# Altium schematic sheet Fan_Control.SchDoc
size A4; SheetNumber: 6; SheetTotal: 7
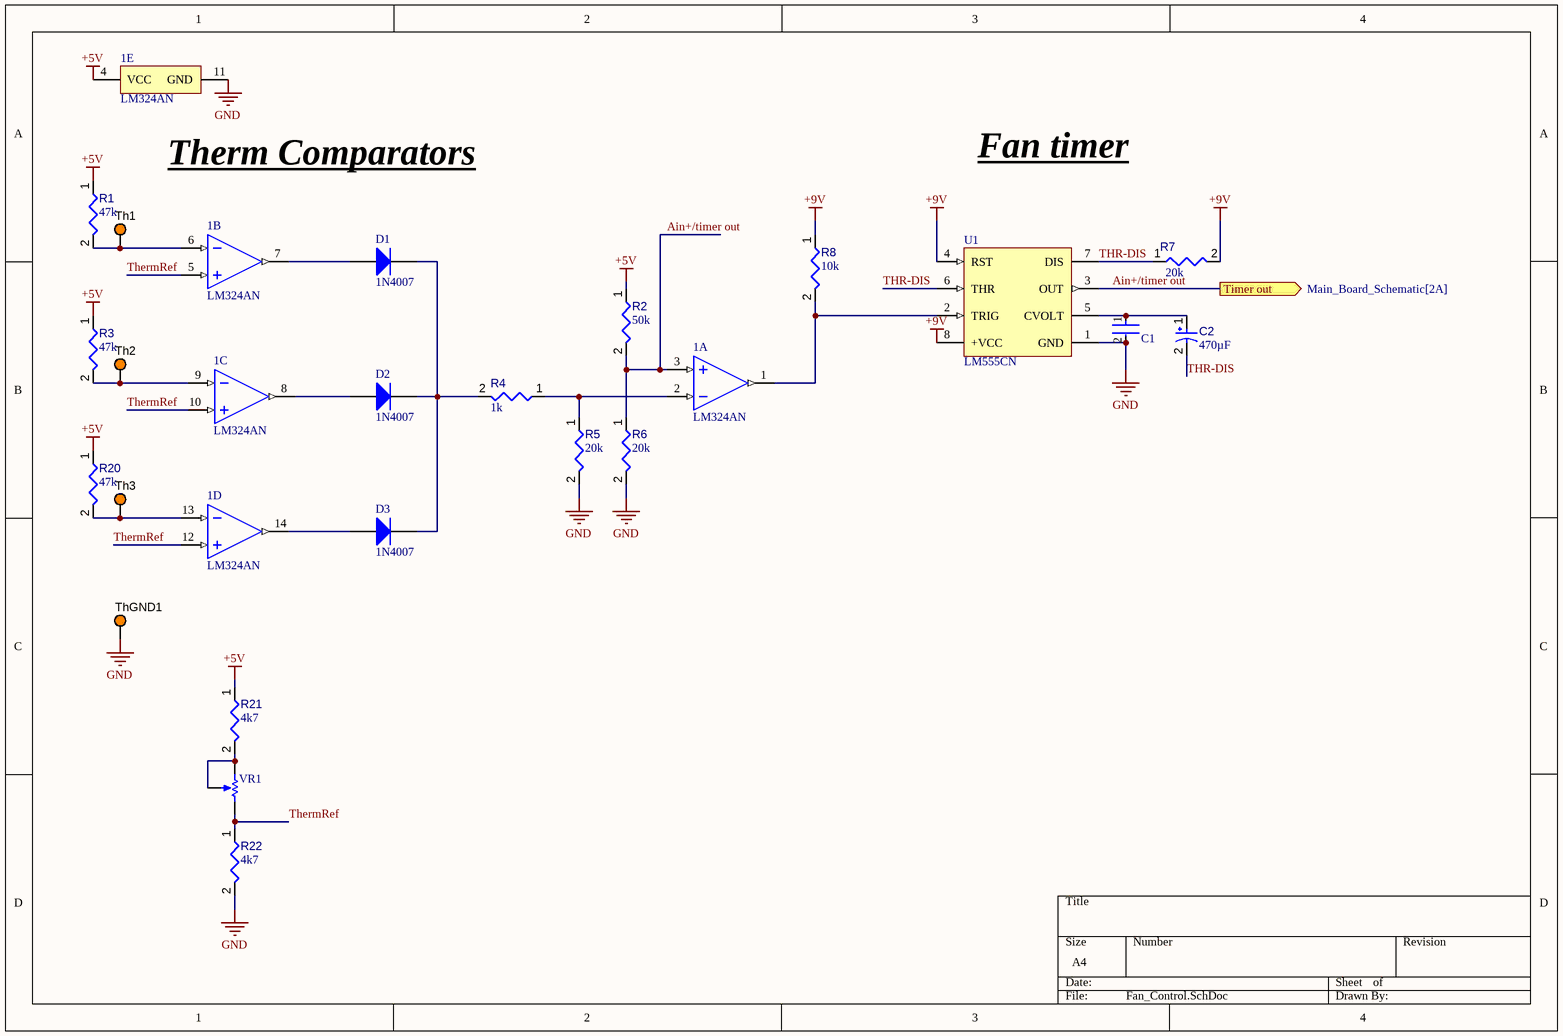
[diagram p0: Fan_Control.SchDoc]

## Parts
1  LM324AN  [TI-N0014A]  (parts A,B,C,D,E of 5)
C1  RCER71H103K0K1H03B  [FP-RCE0K1-MFG]  (value not drawn)
C2  value 470µF  [CAPPR65-350-1150X800X1250]  (hidden comment: ECA1HM101)
D1  1N4007  [FAIR-DO-41-2]
D2  1N4007  [FAIR-DO-41-2]
D3  1N4007  [FAIR-DO-41-2]
R1  value 47k  [RESA60-630X240]  (hidden comment: MFR-25FBF52-100R)
R2  value 50k  [RESA60-630X240]  (hidden comment: MFR-25FBF52-100R)
R3  value 47k  [RESA60-630X240]  (hidden comment: MFR-25FBF52-100R)
R4  value 1k  [RESA60-630X240]  (hidden comment: MFR-25FBF52-100R)
R5  value 20k  [RESA60-630X240]  (hidden comment: MFR-25FBF52-100R)
R6  value 20k  [RESA60-630X240]  (hidden comment: MFR-25FBF52-100R)
R7  value 20k  [RESA60-630X240]  (hidden comment: MFR-25FBF52-1K)
R8  value 10k  [RESA60-630X240]  (hidden comment: MFR-25FBF52-1K)
R20  value 47k  [RESA60-630X240]  (hidden comment: MFR-25FBF52-100R)
R21  value 4k7  [RESA60-630X240]  (hidden comment: MFR-25FBF52-100R)
R22  value 4k7  [RESA60-630X240]  (hidden comment: MFR-25FBF52-100R)
Th1  5003  [KSTN-5003]  (value not drawn)
Th2  5003  [KSTN-5003]  (value not drawn)
Th3  5003  [KSTN-5003]  (value not drawn)
ThGND1  5003  [KSTN-5003]  (value not drawn)
U1  LM555CN  [N08E]
VR1  3362P-1-104LF  [BOUR-3362P]  (value not drawn)

## Ports
Timer out (out, see Main_Board_Schematic[2A])

## Nets
+5V: 1.4(VCC) R1.1 R2.1 R3.1 R20.1 R21.1
+9V: R7.2 R8.1 U1.4(RST) U1.8(+VCC)
GND: 1.11(GND) C1.2 R5.2 R6.2 R22.2 ThGND1.1 U1.1(GND)
Ain+/timer out: 1.3(1IN+) R2.2 R6.1 U1.3(OUT) ; port Timer out
ThermRef: 1.5(2IN+) 1.10(3IN+) 1.12(4IN+) R22.1 VR1.3(CW)
THR-DIS: C2.2 R7.1 U1.6(THR) U1.7(DIS)
Net1_1: 1.1(1OUT) R8.2 U1.2(TRIG)
Net1_2: 1.2(1IN-) R4.1 R5.1
Net1_6: 1.6(2IN-) R1.2 Th1.1
Net1_7: 1.7(2OUT) D1.2(A)
Net1_8: 1.8(3OUT) D2.2(A)
Net1_9: 1.9(3IN-) R3.2 Th2.1
Net1_13: 1.13(4IN-) R20.2 Th3.1
Net1_14: 1.14(4OUT) D3.2(A)
NetC1_1: C1.1 C2.1 U1.5(CVOLT)
NetD1_1: D1.1(K) D2.1(K) D3.1(K) R4.2
NetR21_2: R21.2 VR1.1(CCW) VR1.2(S)

## Notes on the sheet
- Therm Comparators
- Fan timer

## Library data of the parts
1 = CMP-014-00016-2: Quadruple Operational Amplifier, 1.2 MHz, 0 to 70 degC, 14-Pin PDIP (N), Pb-Free (RoHS), Tube; Manufacturer: Texas Instruments (TI); Max Dual Supply Voltage: 16V; Nominal Dual Supply Voltage: 12V; Nominal Voltage Gain: 100dB; Min Supply Voltage: 1.5V; Unity Gain Bandwidth Product: 1.2MHz; Output Current: 30mA; Nominal Supply Current: 3mA; RoHS Compliant: True; Package Reference: N-14; Min Operating Temperature: 0°C; Case/Package: DIP; Mounting Technology: TH; Package Description: 14-Pin Double In-line Package, Body 19.305 x 6.35 mm, Pitch 2.54 mm; Nominal Supply Voltage: 12V; Package URL: http://www.ti.com/lit/ml/mpdi002c/mpdi002c.pdf; Package Quantity: 25; Datasheet Version: SLOS066W, 03/2015; Manufacturer URL: http://www.ti.com/; Datasheet URL: http://www.ti.com/lit/ds/symlink/lm324a.pdf; Min Dual Supply Voltage: 1.5V; Max Supply Voltage: 16V; Pins: 14; Max Operating Temperature: 70°C
C1 = CMP-06035-044411-1: Cap Ceramic 10nF 50V X7R ±10% Radial 5mm +125°C Automotive Bulk; Lead/Base Style: Formed Leads; Lead Diameter: 0.5mm; Resistor Type: Ceramic; Mount: Through Hole; Capacitance: 10nF; Lead Pitch: 0.197inch; Package Quantity: 500; Dielectric: X7R; Lead Free: Lead Free; Min Operating Temperature: -55°C; Packaging: Bulk; Width: 0.098inch; Length: 0.142inch; Voltage Rating: 50V; Case/Package: Radial; Max Operating Temperature: 125°C; Ratings: AEC-Q200; Height - Seated (Max): 0.138inch; Height: 3.5mm; Termination: Radial; Voltage Rating (DC): 50V; Tolerance: 10%
C2 = CMP-001-00026-7: Aluminum Electrolytic Capacitor, 100 uF, +/- 20%, 50 V, -40 to 85 degC, 2-Pin THD, RoHS, Bulk; Manufacturer: Panasonic; Voltage Rating: 50V; Ripple Current: 250mA; Datasheet URL: https://industrial.panasonic.com/cdbs/www-data/pdf/RDF0000/ABA0000C1218.pdf; Lead Pitch: 3.5mm; Mounting Technology: TH; Package Description: 2-Pin Radial Lead, Dia 8 mm, Height 12.5 mm; Diameter: 8mm; Ripple Current (AC): 250mA; Manufacturer URL: http://www.panasonic.com/; Capacitor Type: Electrolytic; Max Operating Temperature: 85°C; Pins: 2; Min Operating Temperature: -40°C; Tolerance: 20%; Case/Package: Radial; Packaging: Bulk; Package Quantity: 200; Package Reference: CAPPR65-350-1150X800X1250; RoHS Compliant: True; Datasheet Version: Rev. 05, 10/2016
D1-D3 = CMP-004-00007-2: General Purpose Rectifier, 1.1 V, 1.0 A, -55 to 175 degC, 2-Pin DO-41, RoHS, Tape and Reel; Manufacturer: Fairchild; Peak Reverse Current: 5uA; Max Surge Current: 30A; Elements: 1; Forward Voltage: 1.1V; Package Version: Rev. 2, 09/2008; Forward Current: 1A; Package Quantity: 5000; Packaging: TapeandReel; Package URL: http://www.fairchildsemi.com/dwg/DO/DO41A.pdf; Manufacturer URL: https://www.fairchildsemi.com/; Package Reference: DO-41-2; Pins: 2; Min Operating Temperature: -55°C; Datasheet Version: Rev. 1.1.0, 11/2014; Max Operating Temperature: 175°C; RoHS Compliant: True; Case/Package: DO-41-2; Mounting Technology: TH; Package Description: 2-Pin Axial Lead, Dia 2.375 mm, Body Length 4.63 mm; Datasheet URL: https://www.fairchildsemi.com/datasheets/1N/1N4007.pdf
R1-R6 R20-R22 = CMP-009-00046-4: Axial Resistor, 100 Ohm, +/- 1%, 0.25 W, -55 to 155 degC, 2-Pin THD, RoHS, Bulk; Manufacturer: Yageo; Voltage Rating: 250V; Power: 250mW; Packaging: Bulk; Max Operating Temperature: 155°C; Mounting Technology: TH; Datasheet Version: Apr-13; Case/Package: Axial; RoHS Compliant: True; Package Description: 2-Pin Axial Lead, Dia 2.4 mm, Body Length 6.3 mm; Package Quantity: 200; Package Reference: MFR-25; Tolerance: 1%; Composition: CarbonFilm; Datasheet URL: http://www.yageo.com/documents/recent/Yageo%20LR_MFR_2013.pdf; Manufacturer URL: http://www.yageo.com/; Min Operating Temperature: -55°C
R7 R8 = CMP-009-00048-4: Axial Resistor, 1 KOhm, +/- 1%, 250 mW, -55 to 155 degC, 2-Pin THD, RoHS, Bulk; Manufacturer: Yageo; Voltage Rating: 250V; Power: 250mW; Min Operating Temperature: -55°C; Max Operating Temperature: 155°C; Tolerance: 1%; Package Reference: MFR-25; Composition: CarbonFilm; Mounting Technology: TH; Packaging: Bulk; Case/Package: Axial; Datasheet URL: http://www.yageo.com/documents/recent/Yageo%20LR_MFR_2013.pdf; Package Quantity: 200; Manufacturer URL: http://www.yageo.com/; Package Description: 2-Pin Axial Lead, Dia 2.4 mm, Body Length 6.3 mm; Datasheet Version: Apr-13; RoHS Compliant: True
Th1-Th3 ThGND1 = CMP-002-00037-2: Test Point, Orange, Height 4.6 mm, Tail Length 3 mm, 1-Pin THD, RoHS; Manufacturer: Keystone; Colour: Orange; Packaging: Bulk; Package Description: 1-Pin Through Hole Device, Dia 2.54 mm; Pins: 1; Package Reference: 5003; Datasheet Version: Jun-15; Case/Package: 5003; Mounting Technology: TH; Connector Type: TestPoint; Diameter: 2.54mm; Contact Material: Bronze; Datasheet URL: http://keyelco.com/userAssets/file/M65p56.pdf; Manufacturer URL: http://www.keyelco.com/; Package Quantity: 10; Contact Plating: Tin; RoHS Compliant: True
U1 = CMP-0056-00017-2: Timer, 8-pin MDIP; Manufacturer: National Semiconductor; CompType: Analog IC; PackageTopMarking: NSUZXYTTE#*LM*555CN; PowerWise: N; PackageReference: N08E; ComponentLink1Description: LM555 Datasheet; ComponentLink3URL: http://www.national.com/packaging/folders/n08e.html; ComponentLink1URL: http://www.national.com/ds/LM/LM555.pdf; ComponentLink2URL: http://www.national.com/pf/LM/LM555.html; PackageDescription: MDIP, .365 x .250 x .130in, 8 Lead, .100in Pitch; DatasheetVersion: Jul-2006; RevisionNote: Component URLs added; Code_JEDEC: MS-001-BA; PinCount: 8; ComponentLink3Description: N08E Package Page; PackageVersion: revG, May-2006; ComponentLink2Description: LM555 Web Page; RoHS: N
VR1 = CMP-009-00040-2: Square Trimpot(R) Trimming Potentiometer, 100 KOhm, 300 V, -55 to 125 degC, 3-Pin THD, RoHS, Tube; Manufacturer: Bourns; Voltage Rating: 300V; Resistance: 100k; Power: 500mW; Tolerance: 10%; RoHS Compliant: True; Mounting Technology: TH; Datasheet URL: http://www.bourns.com/docs/Product-Datasheets/3362.pdf; Min Operating Temperature: -55°C; Composition: Potentiometer; Package Quantity: 250; Lead Pitch: 2.54mm; Case/Package: 3326P; Package Description: 3-Pin Through Hole Device, Body 6.6 x 6.99 mm, Pitch 2.54 mm; Datasheet Version: May-16; Packaging: Rail/Tube; Package Reference: 3326P; Manufacturer URL: http://www.bourns.com/; Max Operating Temperature: 125°C